# Altium schematic sheet Flahser_4CH_555.SchDoc
size A
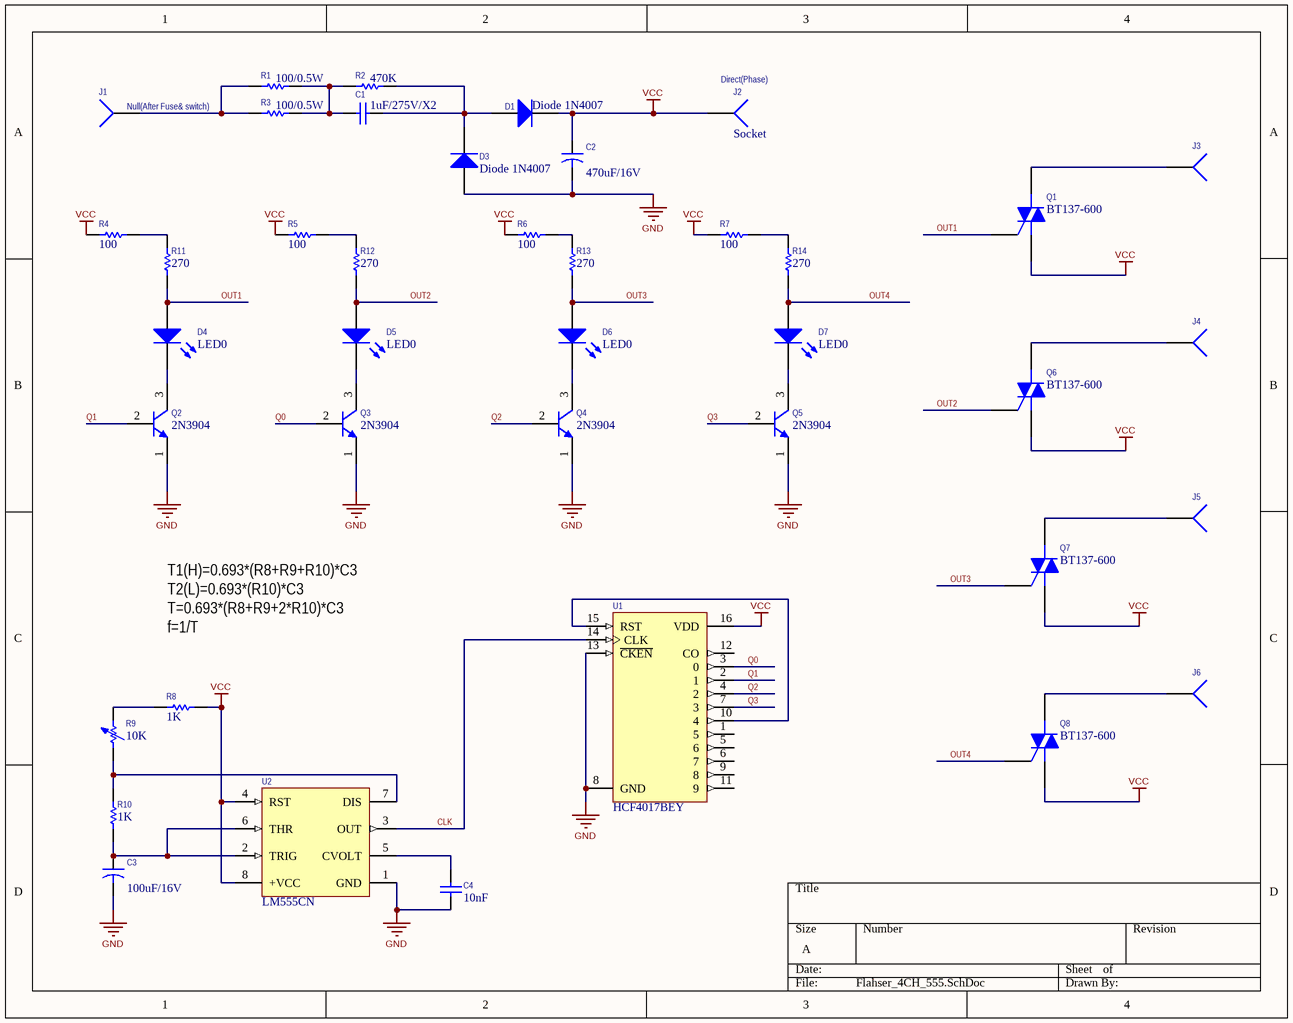
[diagram p0: Flahser_4CH_555.SchDoc]

## Parts
C1  value 1uF/275V/X2  [Cap_polyester_275V_P22.5]  (hidden comment: Cap)
C2  value 470uF/16V  [Cap electrolitic radial 8x12-3.5]  (hidden comment: Cap2)
C3  value 100uF/16V  [Cap electrolitic radial 5x11-2]  (hidden comment: Cap2)
C4  value 10nF  [CAP_MLCC_RAD_0.1]  (hidden comment: Cap)
D1  Diode 1N4007  [DO-204AL]
D3  Diode 1N4007  [DO-204AL]
D4  LED0  [LED5MM_RED]
D5  LED0  [LED5MM_RED]
D6  LED0  [LED5MM_RED]
D7  LED0  [LED5MM_RED]
J1  Socket  [PIN1]  (value not drawn)
J2  Socket  [PIN1]
J3  Socket  [PIN1]  (value not drawn)
J4  Socket  [PIN1]  (value not drawn)
J5  Socket  [PIN1]  (value not drawn)
J6  Socket  [PIN1]  (value not drawn)
Q1  BT137-600  [TO-220 AB with heatsink ya25]
Q2  2N3904  [TO-92 CF]
Q3  2N3904  [TO-92 CF]
Q4  2N3904  [TO-92 CF]
Q5  2N3904  [TO-92 CF]
Q6  BT137-600  [TO-220 AB with heatsink ya25]
Q7  BT137-600  [TO-220 AB with heatsink ya25]
Q8  BT137-600  [TO-220 AB with heatsink ya25]
R1  value 100/0.5W  [Axial 0_5W 5_0mm]  (hidden comment: Res1)
R2  value 470K  [Axial 0_25 W, 0_4 IN LEAD PITCH]  (hidden comment: Res1)
R3  value 100/0.5W  [Axial 0_5W 5_0mm]  (hidden comment: Res1)
R4  value 100  [Axial 0_25 W, 0_4 IN LEAD PITCH]  (hidden comment: Res1)
R5  value 100  [Axial 0_25 W, 0_4 IN LEAD PITCH]  (hidden comment: Res1)
R6  value 100  [Axial 0_25 W, 0_4 IN LEAD PITCH]  (hidden comment: Res1)
R7  value 100  [Axial 0_25 W, 0_4 IN LEAD PITCH]  (hidden comment: Res1)
R8  value 1K  [Axial 0_25 W, 0_4 IN LEAD PITCH]  (hidden comment: Res1)
R9  value 10K  [AXIAL-0.4]  (hidden comment: Res Adj1)
R10  value 1K  [Axial 0_25 W, 0_4 IN LEAD PITCH]  (hidden comment: Res1)
R11  value 270  [Axial 0_25 W, 0_4 IN LEAD PITCH]  (hidden comment: Res1)
R12  value 270  [Axial 0_25 W, 0_4 IN LEAD PITCH]  (hidden comment: Res1)
R13  value 270  [Axial 0_25 W, 0_4 IN LEAD PITCH]  (hidden comment: Res1)
R14  value 270  [Axial 0_25 W, 0_4 IN LEAD PITCH]  (hidden comment: Res1)
U1  HCF4017BEY  [DIP16]
U2  LM555CN  [8P3]

## Nets
GND: C2.2 C3.2 C4.1 D3.1(A) Q2.1(E) Q3.1(E) Q4.1(E) Q5.1(E) U1.8(GND) U1.13(~{CKEN}) U2.1(GND)
VCC: C2.1 D1.2(K) J2.1 Q1.1(M1) Q6.1(M1) Q7.1(M1) Q8.1(M1) R4.2 R5.2 R6.2 R7.2 R8.1 U1.16(VDD) U2.4(RST) U2.8(+VCC)
CLK: U1.14(CLK) U2.3(OUT)
OUT1: D4.1(A) Q1.3(G) R11.2
OUT2: D5.1(A) Q6.3(G) R12.2
OUT3: D6.1(A) Q7.3(G) R13.2
OUT4: D7.1(A) Q8.3(G) R14.2
Q0: Q3.2(B) U1.3(0)
Q1: Q2.2(B) U1.2(1)
Q2: Q4.2(B) U1.4(2)
Q3: Q5.2(B) U1.7(3)
NetC1_1: C1.1 R1.2 R2.1 R3.2
NetC1_2: C1.2 D1.1(A) D3.2(K) R2.2
NetC3_1: C3.1 R10.1 U2.2(TRIG) U2.6(THR)
NetC4_2: C4.2 U2.5(CVOLT)
NetD4_2: D4.2(K) Q2.3(C)
NetD5_2: D5.2(K) Q3.3(C)
NetD6_2: D6.2(K) Q4.3(C)
NetD7_2: D7.2(K) Q5.3(C)
NetJ1_1: J1.1 R1.1 R3.1
NetJ3_1: J3.1 Q1.2(M2)
NetJ4_1: J4.1 Q6.2(M2)
NetJ5_1: J5.1 Q7.2(M2)
NetJ6_1: J6.1 Q8.2(M2)
NetR4_1: R4.1 R11.1
NetR5_1: R5.1 R12.1
NetR6_1: R6.1 R13.1
NetR7_1: R7.1 R14.1
NetR8_2: R8.2 R9.2
NetR9_1: R9.1 R10.2 U2.7(DIS)
NetU1_10: U1.10(4) U1.15(RST)

Not connected (* = marked no-connect by the designer): U1 1(5) 5(6) 6(7) 9(8) 11(9) 12(CO)

## Notes on the sheet
- (near J2) Direct(Phase)
- Null(After Fuse& switch)
- T1(H)=0.693*(R8+R9+R10)*C3
  T2(L)=0.693*(R10)*C3
  T=0.693*(R8+R9+2*R10)*C3
  f=1/T

## Library data of the parts
C1 C4 = Cap: Capacitor; Published: 8-Jun-2000; LatestRevisionDate: 17-Jul-2002; LatestRevisionNote: Re-released for DXP Platform.; PackageReference: RAD-0.3; Publisher: Altium Limited; PackageDescription: Radial Cap, Thru-Hole; 2 Leads; 0.3 in Pin Spacing
C2 C3 = Cap2: Capacitor; Published: 23-Sep-2002; PackageReference: CAPR5-4X5; Publisher: Altium Limited; PackageDescription: Capacitor; 2 Leads
D1 D3 = Diode 1N4007: 1 Amp General Purpose Rectifier; Published: 8-Jun-2000; LatestRevisionDate: 17-Jul-2002; LatestRevisionNote: Re-released for DXP Platform.; DatasheetVersion: 1998; PackageVersion: Aug-1999; PackageReference: DO-41; Publisher: Altium Limited; PackageDescription: Diode, Axial; Body 5.2 x 2.7 mm (LxDia. max), Lead Dia. 0.86 mm (max); Code_JEDEC: DO-204-AL; ComponentLink1Description: Manufacturer Link; ComponentLink1URL: http://www.fairchildsemi.com/; ComponentLink2Description: Datasheet; ComponentLink2URL: http://www.fairchildsemi.com/ds/1N%2F1N4001.pdf
D4-D7 = LED0: Typical INFRARED GaAs LED; Published: 8-Jun-2000; LatestRevisionDate: 08-Jul-2005; LatestRevisionNote: Mech Layer 1 removed.; PackageReference: LED-0; Publisher: Altium Limited; PackageDescription: LED; 2 Leads
Q1 Q6-Q8 = Triac: Silicon Bidirectional Triode Thyristor; Note: Pin 2 is electrically connected to Pin 4 (TAB); Published: 29-Sep-2000; LatestRevisionDate: 17-Jul-2002; LatestRevisionNote: Re-released for DXP Platform.; DatasheetVersion: 1999; PackageReference: 369-03; Publisher: Altium Limited; PackageDescription: TO, Thru-Hole, Vertical, Heatsink Mounted; 3 In-Line Leads; Pitch 2.28 mm; ComponentLink1Description: Manufacturer Link; ComponentLink1URL: http://www.motorola.com/
Q2-Q5 = 2N3904: NPN General Purpose Amplifier; Published: 8-Jun-2000; LatestRevisionDate: 15-Jan-2003; LatestRevisionNote: PCB Footprint 'BCY-W3/D4.7' replaced; DatasheetVersion: 1997; PackageVersion: Sep-1998; PackageReference: TO-92A; Publisher: Altium Limited; PackageDescription: TO, Flat Index; 3 In-Line, Axial Leads; Body Dia. 4.5mm; Leads 0.51 x 0.48 mm (max); ComponentLink1Description: Manufacturer Link; ComponentLink1URL: http://www.fairchildsemi.com/; ComponentLink2Description: Datasheet; ComponentLink2URL: http://www.fairchildsemi.com/ds/2N%2F2N3904.pdf
R1-R8 R10-R14 = Res1: Resistor; Published: 8-Jun-2000; LatestRevisionDate: 17-Jul-2002; LatestRevisionNote: Re-released for DXP Platform.; PackageReference: AXIAL-0.3; Publisher: Altium Limited; PackageDescription: Axial Device, Thru-Hole; 2 Leads; 0.3 in Pin Spacing
R9 = Res Adj1: Variable Resistor; Set Position: 0.5; Published: 8-Jun-2000; LatestRevisionDate: 17-Jul-2002; LatestRevisionNote: Re-released for DXP Platform.; PackageReference: AXIAL-0.7; Publisher: Altium Limited; PackageDescription: Axial Device, Thru-Hole; 2 Leads; 0.7 in Pin Spacing
U1 = HCF4017BEY: Decade Counter with 10 Decoded Outputs; Published: 8-Jun-2000; LatestRevisionDate: 06-Jun-2005; LatestRevisionNote: Stylized 3D Model Added.; DatasheetVersion: Jun-1989; PackageVersion: Apr-1996; PackageReference: DIP16; Publisher: Altium Limited; PackageDescription: DIP; 16 Leads; Row Spacing 7.62 mm; Pitch 2.54 mm; ComponentLink1Description: Manufacturer Link; ComponentLink1URL: http://www.st.com/; ComponentLink2Description: Datasheet; ComponentLink2URL: http://www.st.com/stonline/products/literature/ds/2029/hcf4017.pdf
U2 = LM555CN: Timer, 8-pin MDIP; Manufacturer: National Semiconductor; PackageTopMarking: NSUZXYTTE#*LM*555CN; PowerWise: N; CompType: Analog IC; Published: 4-Dec-2008; DatasheetVersion: Jul-2006; PackageVersion: revG, May-2006; PackageReference: N08E; Publisher: Altium Limited; PackageDescription: MDIP, .365 x .250 x .130in, 8 Lead, .100in Pitch; Supplier 1: Farnell; Supplier Part Number 1: 9488235; PartNumber: LM555CN; RoHS: N; PinCount: 8; Code_JEDEC: MS-001-BA; ComponentLink1Description: LM555 Datasheet; ComponentLink1URL: http://www.national.com/ds/LM/LM555.pdf; ComponentLink2Description: LM555 Web Page; ComponentLink2URL: http://www.national.com/pf/LM/LM555.html; ComponentLink3Description: N08E Package Page; ComponentLink3URL: http://www.national.com/packaging/folders/n08e.html
J1-J6 = Socket: LatestRevisionDate: 17-Jul-2002; LatestRevisionNote: Re-released for DXP Platform.; Publisher: Altium Limited